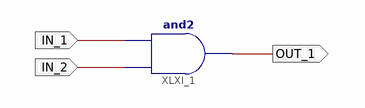
[diagram p0: schematic sheet 1]
// Xilinx ISE schematic Or_ckt.sch (spartan6) as structural Verilog: 1 symbols, 3 ports
module Or_ckt (
  input  IN_1,
  input  IN_2,
  output OUT_1
);

  and XLXI_1 (OUT_1, IN_2, IN_1);
endmodule
